# EasyEDA Pro project stm32h7手持mp3.eprj, schematic Schematic2
Board Name: rk3506; Create Date: 2026-06-15; Page Name: P1; Project Name: stm32h7手持mp3; Schematic Name: Schematic2; Update Date: 2026-06-15; Company: 嘉立创EDA; Page Size: A4; Version: V1.0
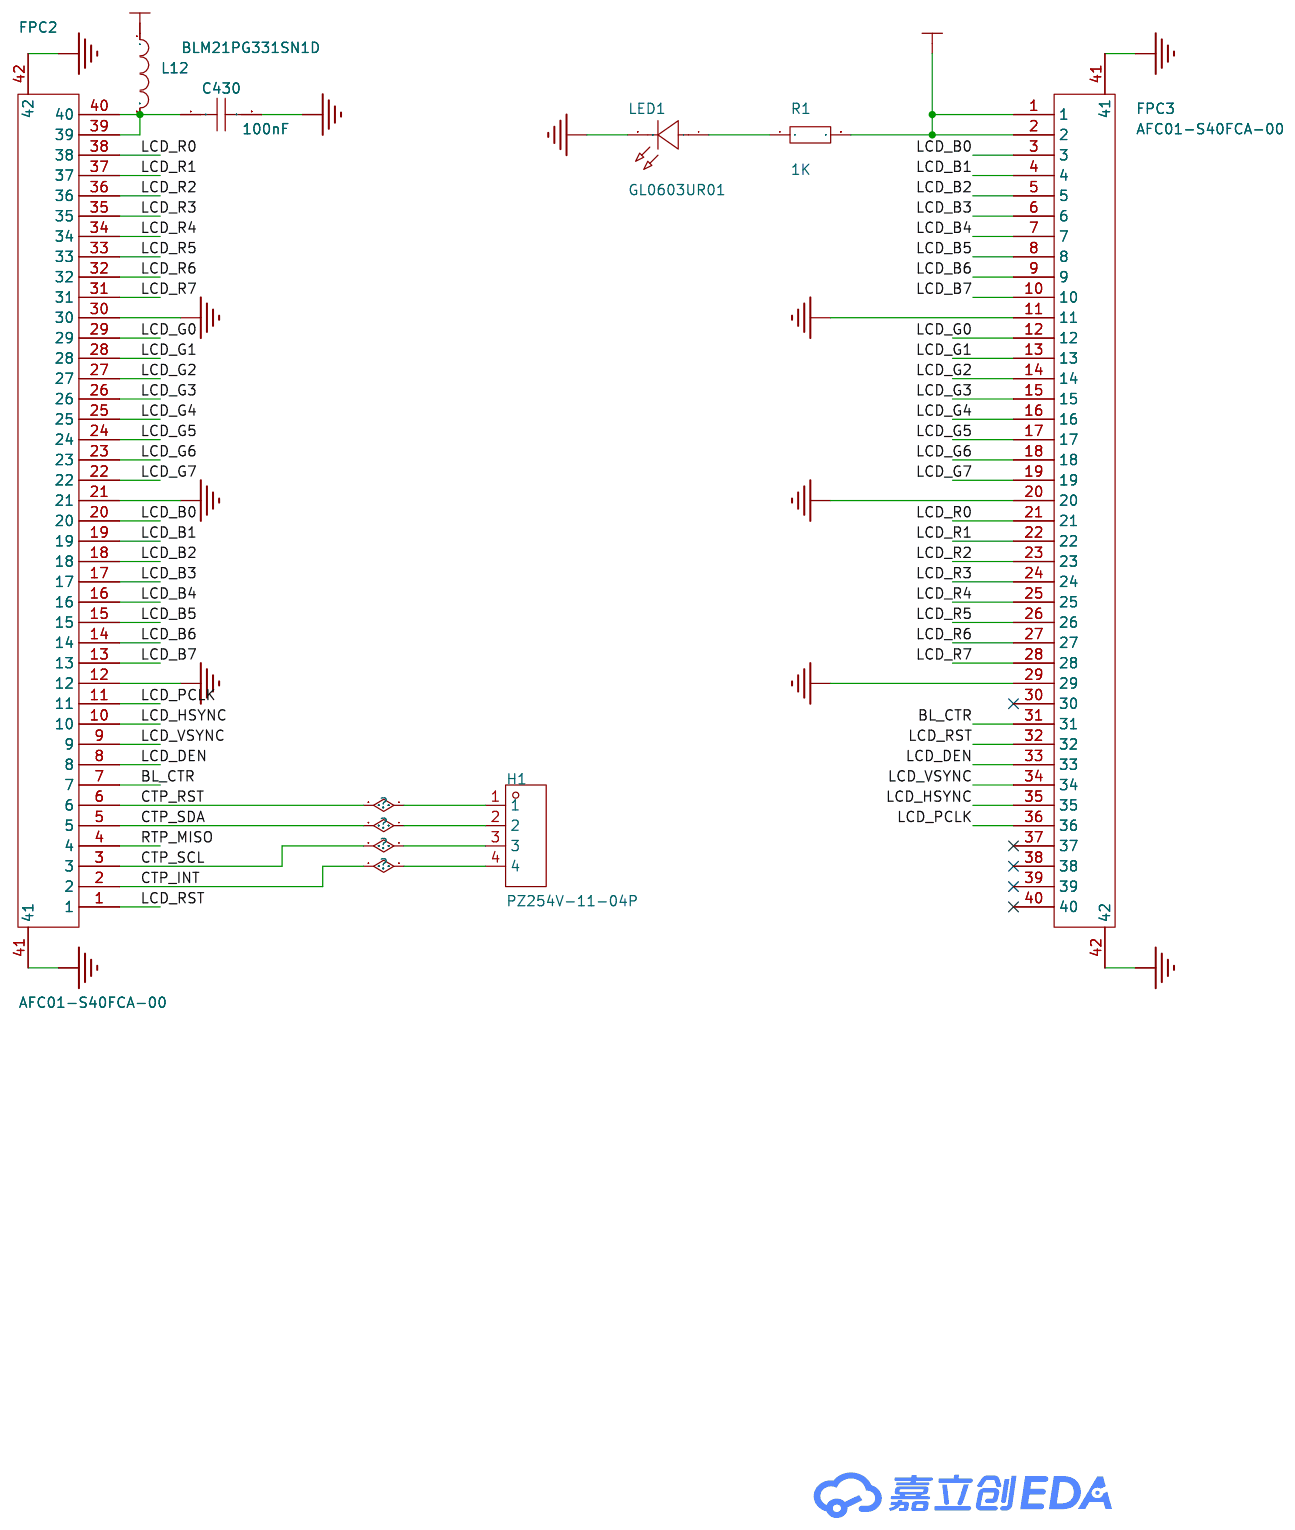
[diagram p1: schematic sheet]

## Parts
C430  100nF  [C0603]
FPC2  AFC01-S40FCA-00  [FPC-SMD_AFC01-S40FCA-00]
FPC3  AFC01-S40FCA-00  [FPC-SMD_AFC01-S40FCA-00]
H1  PZ254V-11-04P  [HDR-TH_4P-P2.54-V-M]
L12  BLM21PG331SN1D  [L0805]
LED1  GL0603UR01  [LED0603-FD]
R1  1K  [R0603]

## Library data of the parts
C430 = CAP_0603: Supplier Footprint: 0603
FPC2 FPC3 = AFC01-S40FCA-00: LCSC Part Name: 翻盖式 下接 P数:40P 间距:0.5mm; Supplier Part: C262674; Manufacturer: JS(钜硕电子); Supplier Footprint: SMD,P=0.5mm,卧贴; JLCPCB Part Class: 扩展库; Datasheet: https://item.szlcsc.com/datasheet/AFC01-S40FCA-00/253933.html; Supplier: LCSC; Locking Feature: 翻盖式; Contact Type: 下接; Number of Contacts: 40P; Pitch: 0.5mm; Mounting Type: 卧贴; FFC, FCB Thickness: 0.3mm; Height Above Board: 2mm; Contact Material: 铜合金; Contact Plating: 锡; Operating Temperature: -45℃~+85℃; Rated Voltage (Max): 50V; Current Rating (Max): 500mA
H1 = PZ254V-11-04P: LCSC Part Name: 1x4P 间距:2.54mm 方针 直插; Supplier Part: C2691448; Manufacturer: XFCN(兴飞); Supplier Footprint: 插件,P=2.54mm; JLCPCB Part Class: Extended Part; Datasheet: https://item.szlcsc.com/datasheet/PZ254V-11-04P/2801085.html; Supplier: LCSC; Pin Structure: 1x4P; Pitch: 2.54mm; Circluar Pins/Square Pins: 方针; Mounting Type: 直插; Number of Rows: 单排; Number of Pins: 4P; Current Rating: 3A; Voltage Rating (Max): 250V; Length of Mating Pin: 6mm; Insulation Height: 2.5mm; Length of End Connection Pin: 3mm; Operating Temperature: -40℃~+105℃; Color: 黑色
L12 = BLM21PG331SN1D: LCSC Part Name: 单路 0805磁珠 阻抗330Ω@100MHz; Supplier Part: C74764; Manufacturer: muRata(村田); Supplier Footprint: 0805; JLCPCB Part Class: 扩展库; Datasheet: https://item.szlcsc.com/datasheet/BLM21PG331SN1D/75886.html; Supplier: LCSC; Impedance @ Frequency: 330Ω@100MHz; Tolerance: ±25%; DC Resistance(DCR): 70mΩ; Current Rating: 1.5A; Number of Circuits: 1
LED1 = GL0603UR01: LCSC Part Name: 0603 红灯 高亮; Supplier Part: C51933292; Manufacturer: Guiguang light(桂光光电); Supplier Footprint: 0603; JLCPCB Part Class: 扩展库; Datasheet: https://item.szlcsc.com/datasheet/GL0603UR01/54645988.html; Supplier: LCSC; Illumination Color: 红色; Voltage - Forward(Vf): 2.4V; Forward Current: 20mA; Wavelength - Dominant: 620nm~625nm; Diode Configuration: 独立二极管; Lens Color: 无色透明透镜; Luminous Intensity: 120mcd; Viewing Angle: 120°; Mounting Style: 正贴; Operating Temperature: -40℃~+85℃
R1 = Res_0603: Supplier Footprint: 0603

## Nets
GND: C430.2 FPC2.12 FPC2.21 FPC2.30 FPC2.41 FPC2.42 FPC3.11 FPC3.20 FPC3.29 FPC3.41 FPC3.42 LED1.2(C)
VCC5V: FPC3.1 FPC3.2 L12.1 R1.2
BL_CTR: FPC2.7 FPC3.31
CTP_INT: FPC2.2 H1.4
CTP_RST: FPC2.6 H1.1
CTP_SCL: FPC2.3 H1.3
CTP_SDA: FPC2.5 H1.2
LCD_B0: FPC2.20 FPC3.3
LCD_B1: FPC2.19 FPC3.4
LCD_B2: FPC2.18 FPC3.5
LCD_B3: FPC2.17 FPC3.6
LCD_B4: FPC2.16 FPC3.7
LCD_B5: FPC2.15 FPC3.8
LCD_B6: FPC2.14 FPC3.9
LCD_B7: FPC2.13 FPC3.10
LCD_DEN: FPC2.8 FPC3.33
LCD_G0: FPC2.29 FPC3.12
LCD_G1: FPC2.28 FPC3.13
LCD_G2: FPC2.27 FPC3.14
LCD_G3: FPC2.26 FPC3.15
LCD_G4: FPC2.25 FPC3.16
LCD_G5: FPC2.24 FPC3.17
LCD_G6: FPC2.23 FPC3.18
LCD_G7: FPC2.22 FPC3.19
LCD_HSYNC: FPC2.10 FPC3.35
LCD_PCLK: FPC2.11 FPC3.36
LCD_R0: FPC2.38 FPC3.21
LCD_R1: FPC2.37 FPC3.22
LCD_R2: FPC2.36 FPC3.23
LCD_R3: FPC2.35 FPC3.24
LCD_R4: FPC2.34 FPC3.25
LCD_R5: FPC2.33 FPC3.26
LCD_R6: FPC2.32 FPC3.27
LCD_R7: FPC2.31 FPC3.28
LCD_RST: FPC2.1 FPC3.32
LCD_VSYNC: FPC2.9 FPC3.34
RTP_MISO: FPC2.4
$1N360: C430.1 FPC2.39 FPC2.40 L12.2
$1N1307: LED1.1(A) R1.1

Not connected (* = marked no-connect by the designer): FPC3 30* 37* 38* 39* 40*
